# EAGLE design tractor (EAGLE 7.7.0)
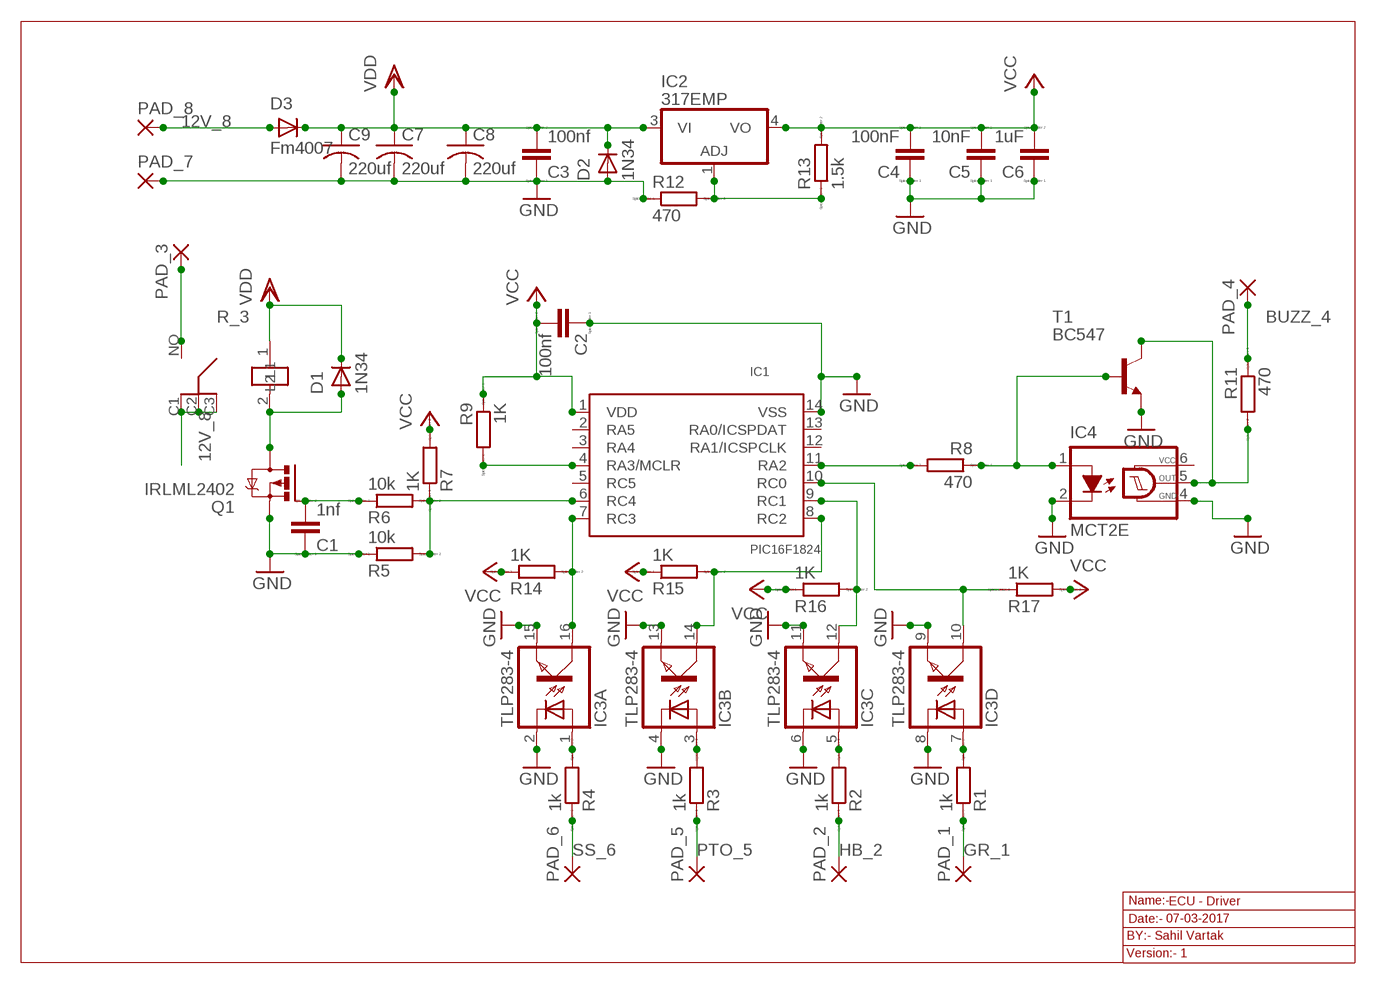
[diagram p0: schematic, sheet 1]

## Parts
C1  1nf  CC0603  [C0603]
C2  100nf  CC0603  [C0603]
C3  100nf  CC0603  [C0603]
C4  100nF  CC0603  [C0603]
C5  10nF  CC0603  [C0603]
C6  1uF  CC0603  [C0603]
C7  220uf  C-US025-025X050  [C025-025X050]
C8  220uf  C-US025-025X050  [C025-025X050]
C9  220uf  C-US025-025X050  [C025-025X050]
D1  1N34  GF1  [SMA-DO214AC]
D2  1N34  GF1  [SMA-DO214AC]
D3  Fm4007  GF1  [SMA-DO214AC]
IC1  PIC16F1824  [SO-14]
IC2  317EMP  [SOT223]
IC3  TLP283-4  [MINI-FLAT-16]
IC4  MCT2E  H11L1MS  [DIL6-SMD]
PAD_1  2,54/1,1  [2,54/1,1]
PAD_2  2,54/1,1  [2,54/1,1]
PAD_3  2,54/1,1  [2,54/1,1]
PAD_4  2,54/1,1  [2,54/1,1]
PAD_5  2,54/1,1  [2,54/1,1]
PAD_6  2,54/1,1  [2,54/1,1]
PAD_7  2,54/1,1  [2,54/1,1]
PAD_8  2,54/1,1  [2,54/1,1]
Q1  IRLML2402  IRLML5203  [MICRO3]
R1  1k  RR0603  [R0603]
R2  1k  RR0603  [R0603]
R3  1k  RR0603  [R0603]
R4  1k  RR0603  [R0603]
R5  10k  RR0603  [R0603]
R6  10k  RR0603  [R0603]
R7  1K  RR0603  [R0603]
R8  470  RR0603  [R0603]
R9  1K  RR0603  [R0603]
R11  470  RR0603  [R0603]
R12  470  RR0603  [R0603]
R13  1.5k  RR0603  [R0603]
R14  1K  RR0603  [R0603]
R15  1K  RR0603  [R0603]
R16  1K  RR0603  [R0603]
R17  1K  RR0603  [R0603]
T1  BC547  [TO92]
U$1  RL703  [RL703]

## Nets
12V_8: D3.A PAD_8.1(P) U$1.C1 U$1.C2 U$1.C3
BUZZ_4: PAD_4.1(P) R11.1
GND: C1.1 C2.1 C3.1 C4.1 C5.1 C6.1 C7.2 C8.2 C9.2 D2.A IC1.14(VSS) IC3.2(A:C) IC3.4(B:C) IC3.6(C:C) IC3.8(D:C) IC3.9(D:EMIT) IC3.11(C:EMIT) IC3.13(B:EMIT) IC3.15(A:EMIT) IC4.2(C) IC4.4(GND) PAD_7.1(P) Q1.2(S) R5.1 R12.1 T1.1(E)
GR_1: PAD_1.1(P) R1.1
HB_2: PAD_2.1(P) R2.1
N$3: IC1.10(RC0) IC3.10(D:COL) R17.1
N$5: D1.A Q1.3(D) U$1.2(L1)
N$14: IC2.1(ADJ) R12.2 R13.1
N$72: C1.2 Q1.1(G) R6.1
N$74: IC1.6(RC4) R5.2 R6.2 R7.1
N$76: IC3.1(A:A) R4.2
N$78: IC3.3(B:A) R3.2
N$80: IC3.5(C:A) R2.2
N$82: IC3.7(D:A) R1.2
N$84: IC1.9(RC1) IC3.12(C:COL) R16.2
N$85: IC1.8(RC2) IC3.14(B:COL) R15.2
N$86: IC1.7(RC3) IC3.16(A:COL) R14.2
N$87: IC1.4(RA3/MCLR) R9.2
N$88: IC1.11(RA2) R8.2
N$89: IC4.1(A) R8.1 T1.2(B)
N$90: IC4.5(OUT) R11.2 T1.3(C)
PTO_5: PAD_5.1(P) R3.1
R_3: PAD_3.1(P) U$1.NO
SS_6: PAD_6.1(P) R4.1
VCC: C2.2 C4.2 C5.2 C6.2 IC1.1(VDD) IC2.4(VO) R7.2 R9.1 R13.2 R14.1 R15.1 R16.1 R17.2
VDD: C3.2 C7.1 C8.1 C9.1 D1.K(C) D2.K(C) D3.K(C) IC2.3(VI) U$1.1(L2)
Unconnected: IC1.2(RA5) IC1.3(RA4) IC1.5(RC5) IC1.12(RA1/ICSPCLK) IC1.13(RA0/ICSPDAT)

## Notes on the sheet
- Name:- | ECU - Driver
- Date:- | 07-03-2017
- BY:- Sahil Vartak
- Version:- 1

## Power pins joined to a net without a drawn wire
VCC: IC4.6(VCC)

## Library data of the parts
C1-C6 = eagle-ltspice:C: CAPACITOR, European symbol; SPICEMODEL: NONE; SPICEPREFIX: C
C7-C9 = rcl:C-US: CAPACITOR, American symbol
D1-D3 = diode:GF1: DIODE
IC1 = microchip:PIC16F1824
IC2 = lm317:*317: Positive VOLTAGE REGULATOR
IC3 = optocoupler:TLP283-4: TOSHIBA PHOTOCOUPLER GaAs IRED & PHOTO-TRANSISTOR Source: http://www.semicon.toshiba.co.jp/td/en/Opto/Photocoupler/en_20050928_TLP283_datasheet.pdf; OC_FARNELL: unknown; OC_NEWARK: unknown
IC4 = optocoupler:H11L*M: 6-Pin DIP Optocoupler Source: http://www.fairchildsemi.com/ds/H1/H11L2-M.pdf; OC_FARNELL: unknown; OC_NEWARK: unknown
PAD_1-PAD_8 = wirepad:2,54/1,1: THROUGH-HOLE PAD
Q1 = transistor-power:IRLML5203: HEXFET P-Channel Power MOSFET
R1-R9 R11-R17 = eagle-ltspice:R: RESISTOR, European symbol; SPICEMODEL: NONE; SPICEPREFIX: R
T1 = transistor-neu-to92:BC547: NPN TRANSISTOR
U$1 = relay:RL703

## Board
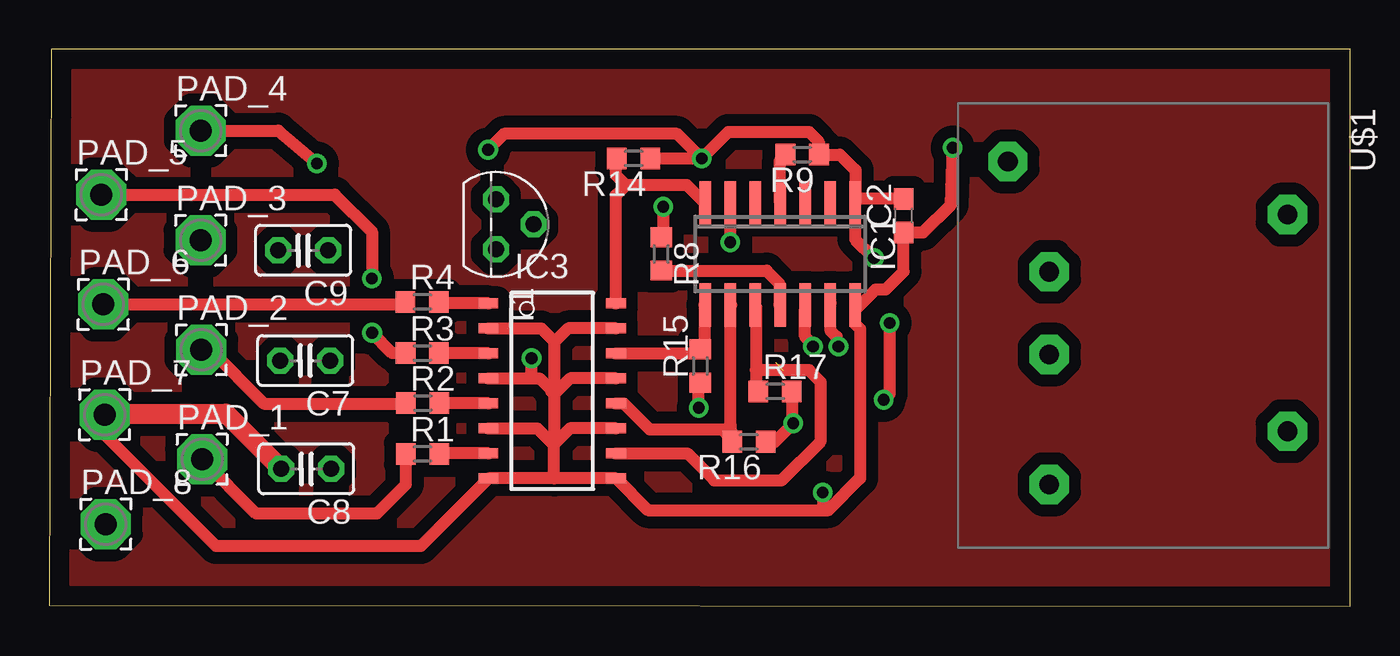
[diagram p1: board, top side]
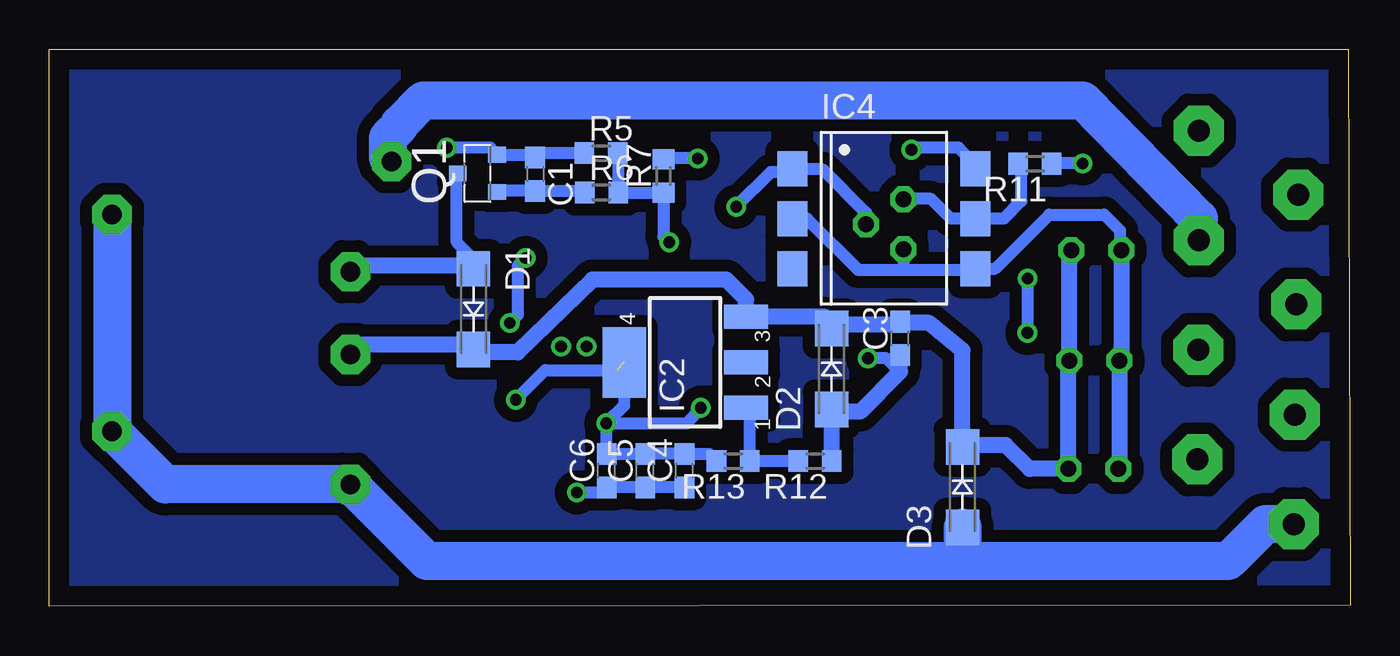
[diagram p2: board, bottom side, seen from below]

Size 66.1 x 28.3 mm. Coordinates in mm from the lower left corner, seen from the top.
Outline: 0,0.06 66.1,0 66.1,28.3 0.1,28.3 0,0.06
Copper layers (1*16): Top 0.035mm / dielectric 1.5mm / Bottom 0.035mm
Design rules "default": minimum track width 10mil, minimum drill 24mil, track to track 8mil, track to pad 8mil, pad to pad 8mil, via to via 8mil, smd to smd 8mil, copper to edge 40mil, drill to drill 8mil, minimum pad ring 10mil, minimum via ring 8mil, stop-mask expansion 4mil, vias tented up to drill 0mil, thermal gap 10mil

### Footprints (pad centres in the part's own frame; a part is rotated, then mirrored left to right if it is on the bottom)
C0603 = smd 1.1 x 1: 1 -0.85,0; 2 0.85,0
C025-025X050 = drill 0.813 octagon: 1 -1.27,0; 2 1.27,0
SMA-DO214AC = smd 1.8 x 1.7: A -2.05,0; K 2.05,0
SO-14 = smd 0.6 x 2.2: 1 -3.81,-2.6; 2 -2.54,-2.6; 3 -1.27,-2.6; 4 0,-2.6; 5 1.27,-2.6; 6 2.54,-2.6; 7 3.81,-2.6; 8 3.81,2.6; 9 2.54,2.6; 10 1.27,2.6; 11 0,2.6; 12 -1.27,2.6; 13 -2.54,2.6; 14 -3.81,2.6
SOT223 = smd 1.219 x 2.235: 1 -2.311,-3.099; 2 0,-3.099; 3 2.311,-3.099 | smd 3.6 x 2.2: 4 0,3.099
MINI-FLAT-16 = smd 1 x 0.5: 1 -3.24,4.445; 2 -3.24,3.175; 3 -3.24,1.905; 4 -3.24,0.635; 5 -3.24,-0.635; 6 -3.24,-1.905; 7 -3.24,-3.175; 8 -3.24,-4.445; 9 3.24,-4.445; 10 3.24,-3.175; 11 3.24,-1.905; 12 3.24,-0.635; 13 3.24,0.635; 14 3.24,1.905; 15 3.24,3.175; 16 3.24,4.445
DIL6-SMD = smd 1.78 x 1.52: 1 -2.54,-4.645; 2 0,-4.645; 3 2.54,-4.645; 4 2.54,4.645; 5 0,4.645; 6 -2.54,4.645
2,54/1,1 = drill 1.118 pad 2.54 octagon: 1 0,0
MICRO3 = smd 0.8 x 0.9: 1 -0.95,-1; 2 0.95,-1; 3 0,1
R0603 = smd 1 x 1.1: 1 -0.85,0; 2 0.85,0
TO92 = drill 0.813 octagon: 1 1.27,0; 2 0,1.905; 3 -1.27,0
RL703 = drill 1 pad 2 octagon: 1 2.4,-6.093; 2 -1.8,-6.093; C1 9,-6.093; C2 6.3,6.007; C3 -4.7,6.007; NO -7.4,-8.193

### Placement (x,y rotation side)
C1  41.41,21.95 270 bottom
C2  43.41,19.85 90 top
C3  22.87,13.61 90 bottom
C4  33.82,6.9 90 bottom
C5  35.82,6.9 90 bottom
C6  37.77,6.9 90 bottom
C7  13.01,12.49 180 top
C8  13.06,6.99 180 top
C9  12.91,18.09 180 top
D1  44.54,15.1 270 bottom
D2  26.35,12.06 90 bottom
D3  19.7,6.06 90 bottom
IC1  37.14,17.9 180 top
IC2  33.79,12.39 90 bottom
IC3  25.55,10.95 0 top
IC4  23.7,19.7 270 bottom
PAD_1  7.76,7.47 0 top
PAD_2  7.73,13.03 0 top
PAD_3  7.69,18.6 0 top
PAD_4  7.7,24.17 0 top
PAD_5  2.65,20.92 0 top
PAD_6  2.75,15.35 0 top
PAD_7  2.82,9.74 0 top
PAD_8  2.87,4.18 0 top
Q1  44.34,21.99 90 bottom
R1  18.97,7.75 0 top
R2  18.97,10.33 0 top
R3  18.95,12.87 0 top
R4  18.95,15.47 0 top
R5  38.06,23.02 0 bottom
R6  38.04,21.02 0 bottom
R7  34.89,21.86 90 bottom
R8  31.09,17.91 270 top
R9  38.25,22.95 180 top
R11  16.02,22.48 180 bottom
R12  27.19,7.38 180 bottom
R13  31.35,7.38 180 bottom
R14  29.69,22.75 180 top
R15  33.08,12.21 90 top
R16  35.54,8.36 180 top
R17  36.88,10.92 0 top
T1  22.7,19.4 270 top
U$1  56.9,15.2 270 top

### Tracks (layer width: path | path; a pad name or v marks a point on that pad's centre or on a via)
12V_8
  Bottom 1.93: PAD_8.1 4.31,4.18 6.2,2.3 19.8,2.3 | D3.A 19.7,2.4 19.8,2.3 | 19.8,2.3 46.9,2.3 U$1.C1 60.2,6.2 U$1.C2 U$1.C3
BUZZ_4  (via drill 0.6)
  Top 0.61: PAD_4.1 11.63,24.17 v13.6,22.5
  Bottom 0.61: v13.6,22.5 15.15,22.5 R11.1
GND  (via drill 0.6)
  Top 0.61: 25.66,6.51 IC3.9 30.4,4.9 39.3,4.9 | 25.66,6.51 IC3.8 18.88,3.08 8.46,3.08 2.82,8.72 PAD_7.1 | IC3.11 26.46,9.05 25.66,8.25 | 25.62,8.21 25.62,6.54 25.66,6.51 | IC3.6 24.79,9.05 25.62,8.21 | IC3.4 24.5,11.59 | 24.5,11.59 24.9,11.59 25.51,10.98 25.51,10.92 25.62,10.81 | 25.62,10.81 25.66,10.77 | 25.66,10.77 25.66,8.25 | 25.66,8.25 25.62,8.21 | IC3.13 26.47,11.59 25.66,10.77 | IC3.2 25,14.13 25.68,13.44 | 25.62,10.81 25.68,10.88 25.68,13.44 | IC3.15 26.36,14.13 25.68,13.44 | v45.9,23.3 45.8,20.4 44.39,19 C2.1 43.4,18.98 43.4,17 42.5,16.1 42,16.1 41.14,15.24 41.01,15.24 IC1.14 40.95,14.35 41.2,14.1 41.2,6.5 39.6,4.9 39.3,4.9 | 24.5,11.59 v24.5,12.6 | v39.3,5.79 39.3,4.9
  Top 1.016: PAD_7.1 2.88,9.8 8.98,9.8 C8.2
  Bottom 0.61: R5.1 41.19,23.02 C1.1 41.55,22.94 Q1.2 43.7,23.3 v45.9,23.3 | 11.8,18.25 C9.2 11.7,18.15 11.7,19.1 12.5,19.9 15.3,19.9 18.04,17.16 IC4.4 19.11,17.1 22.8,17.1 | C4.1 C5.1 C6.1 38.03,5.79 v39.3,5.79 | 22.87,11.93 23.55,12.6 v24.5,12.6 | IC4.2 27.6,19.7 25,17.1 22.8,17.1 | T1.1 22.7,17.2 22.8,17.1
  Bottom 0.813: C9.2 11.64,12.59 C7.2 11.74,7.04 C8.2 | 26.17,10.3 D2.A | R12.1 26.34,10.12 D2.A | C3.1 22.87,11.93 24.9,9.9 26.24,9.9 D2.A
GR_1
  Top 0.61: R1.1 18.12,6.19 16.64,4.71 10.52,4.71 PAD_1.1
HB_2
  Top 0.61: R2.1 18.09,10.3 10.9,10.3 8.17,13.03 PAD_2.1
N$1
  pour Bottom (isolate 0.61): 0.1,28.3 66.1,28.3 66.1,0.1 0.1,0.1
N$2  (via drill 0.6)
  Top 0.61: v38.8,13.2 38.7,13.4 38.4,13.7 38.4,15.1
N$3
  Top 0.61: IC1.10 35.9,15.27 35.9,12 | 35.9,12 35.9,11.05 R17.1 | IC3.10 32.42,7.78 33.8,6.4 37.2,6.4 39.2,8.4 39.2,11.4 38.6,12 35.9,12
N$4  (via drill 0.6)
  Top 0.61: v40.1,13.2 40,13.7 39.7,14 39.7,15.4
N$5
  Bottom 0.61: 44.89,17.5 44.69,17.3 D1.A 44.54,17.64 45.4,18.5 45.4,21.94 Q1.3
  Bottom 0.813: 44.69,17.3 50.5,17.3 U$1.2
N$6
  pour Top (isolate 0.61): 0.2,28.3 66.1,28.3 66.1,0.1 0.2,0.1
N$14
  Bottom 0.61: IC2.1 30.5,9.89 R13.1 R12.2
N$72
  Bottom 0.61: R6.1 38.97,21.1 C1.2 43.28,21.1 Q1.1
N$74  (via drill 0.6)
  Top 0.61: IC1.6 v34.6,18.5
  Bottom 0.61: R5.2 37.21,21.04 R6.2 34.9,21.02 R7.1 34.89,18.79 v34.6,18.5
N$76
  Top 0.61: IC3.1 19.87,15.4 R4.2
N$78
  Top 0.61: IC3.3 19.81,12.86 R3.2
N$80
  Top 0.61: IC3.5 19.83,10.32 R2.2
N$82
  Top 0.61: IC3.7 19.84,7.78 R1.2
N$84
  Top 0.61: 34.66,15.3 IC1.9 34.6,9.36 R16.2 34.23,9 30.5,9 29.18,10.32 IC3.12
N$85
  Top 0.61: IC1.8 33.28,15.3 33.28,13.26 R15.2 | 33.09,12.86 R15.2 | IC3.14 32.87,12.86 R15.2
N$86
  Top 0.61: IC3.16 28.79,20.89 29.3,21.4 | IC1.7 33.33,20.47 | 33.33,19.73 33.33,20.47 | 33.33,20.47 32.4,21.4 29.3,21.4 | 29.3,21.4 28.8,21.9 28.8,22.72 R14.2
N$87
  Top 0.61: IC1.4 37.14,22.69 R9.2
N$88
  Top 0.61: R8.2 36.44,17.05 37.1,16.4 37.1,15.34 IC1.11
N$89  (via drill 0.6)
  Top 0.61: R8.1 31.2,18.77 v31.2,20.3
  Bottom 0.61: 31.1,20.4 v31.2,20.3 29.44,22.05 28.34,22.05 IC4.1 28.3,22.2 26.8,22.2 24.6,20 T1.2
N$90
  Bottom 0.61: R11.2 16.7,22.31 16.7,20.6 17.6,19.7 IC4.5 20.3,19.7 21.3,20.7 22.67,20.7 T1.3
PTO_5  (via drill 0.6)
  Top 0.61: PAD_5.1 14.51,20.92 16.39,19.03 v16.39,16.66 | R3.1 17.43,12.87 v16.4,13.9 v16.39,13.9
  Bottom 0.61: v16.39,16.66 v16.39,13.9 v16.4,13.9
R_3
  Bottom 1.93: PAD_3.1 7.69,19.69 13.6,25.7 47.1,25.7 48.3,24.5 48.3,24.4 48.9,23.8 48.9,22.79 U$1.NO
SS_6
  Top 0.61: PAD_6.1 17.97,15.35 R4.1
VCC  (via drill 0.6)  (1 unrouted)
  Top 0.61: C2.2 41.14,20.7 IC1.1 | 39.13,22.98 R9.1 | R9.1 40.17,22.95 40.96,22.15 40.96,20.52 IC1.1 | R9.1 39.1,23.6 38.6,24.1 34.5,24.1 v33.15,22.75 | v33,10.1 33,11.28 R15.1 | 37.74,9.36 v37.8,9.3 | IC1.1 40.95,18.65 v41.9,17.7 | v42.7,14.4 42.7,10.8 v42.4,10.5 | v33.15,22.75 v33.14,22.75 31.9,24 23.1,24 v22.3,23.2 | R14.1 v33.15,22.75 | R17.2 37.73,9.37 v37.8,9.3 | R16.1 36.86,8.36 v37.8,9.3
  Bottom 0.61: v37.8,9.3 37.8,7.77 C6.2 C5.2 C4.2 32.57,7.75 R13.2 | v33.15,22.75 34.85,22.75 R7.2 | v37.8,9.3 33.7,9.3 v33,10.1 | IC2.4 36.89,10.21 v37.8,9.3 | v41.9,17.7 42.3,17.3 42.3,14.8 v42.7,14.4 | IC4.6 19.11,22.3 19.11,22.52 19.9,23.3 22.2,23.3 v22.3,23.2 | v42.4,10.5 40.9,12 37.28,12
VDD
  Bottom 0.61: 26.64,14.71 D2.K | 23.02,14.31 C3.2 | 44.77,13.05 D1.K 44.79,13.3
  Bottom 0.813: C9.1 14.28,17.99 C7.1 14.33,12.44 C8.1 16.29,6.99 17.5,8.2 19.61,8.2 D3.K 19.7,13 21.4,14.4 22.81,14.4 C3.2 | D1.K 44.39,12.9 42.3,12.9 38.5,16.6 31.7,16.6 30.69,15.6 IC2.3 26.64,14.71 | 23.02,14.31 26.15,14.31 D2.K | 44.79,13.3 50.3,13.3 U$1.1